# Altium schematic sheet USB.SchDoc: USB
size 431 x 279 mm; CheckedBy: Lance Bantoto; Engineer: Cindy Li; Organization: UW Robotics; Address1: 200 University Avenue; Address2: Waterloo; Address3: Ontario; Address4: Canada N2L 3G6; DocumentNumber: 13; Revision: 1; SheetNumber: 13; SheetTotal: 23
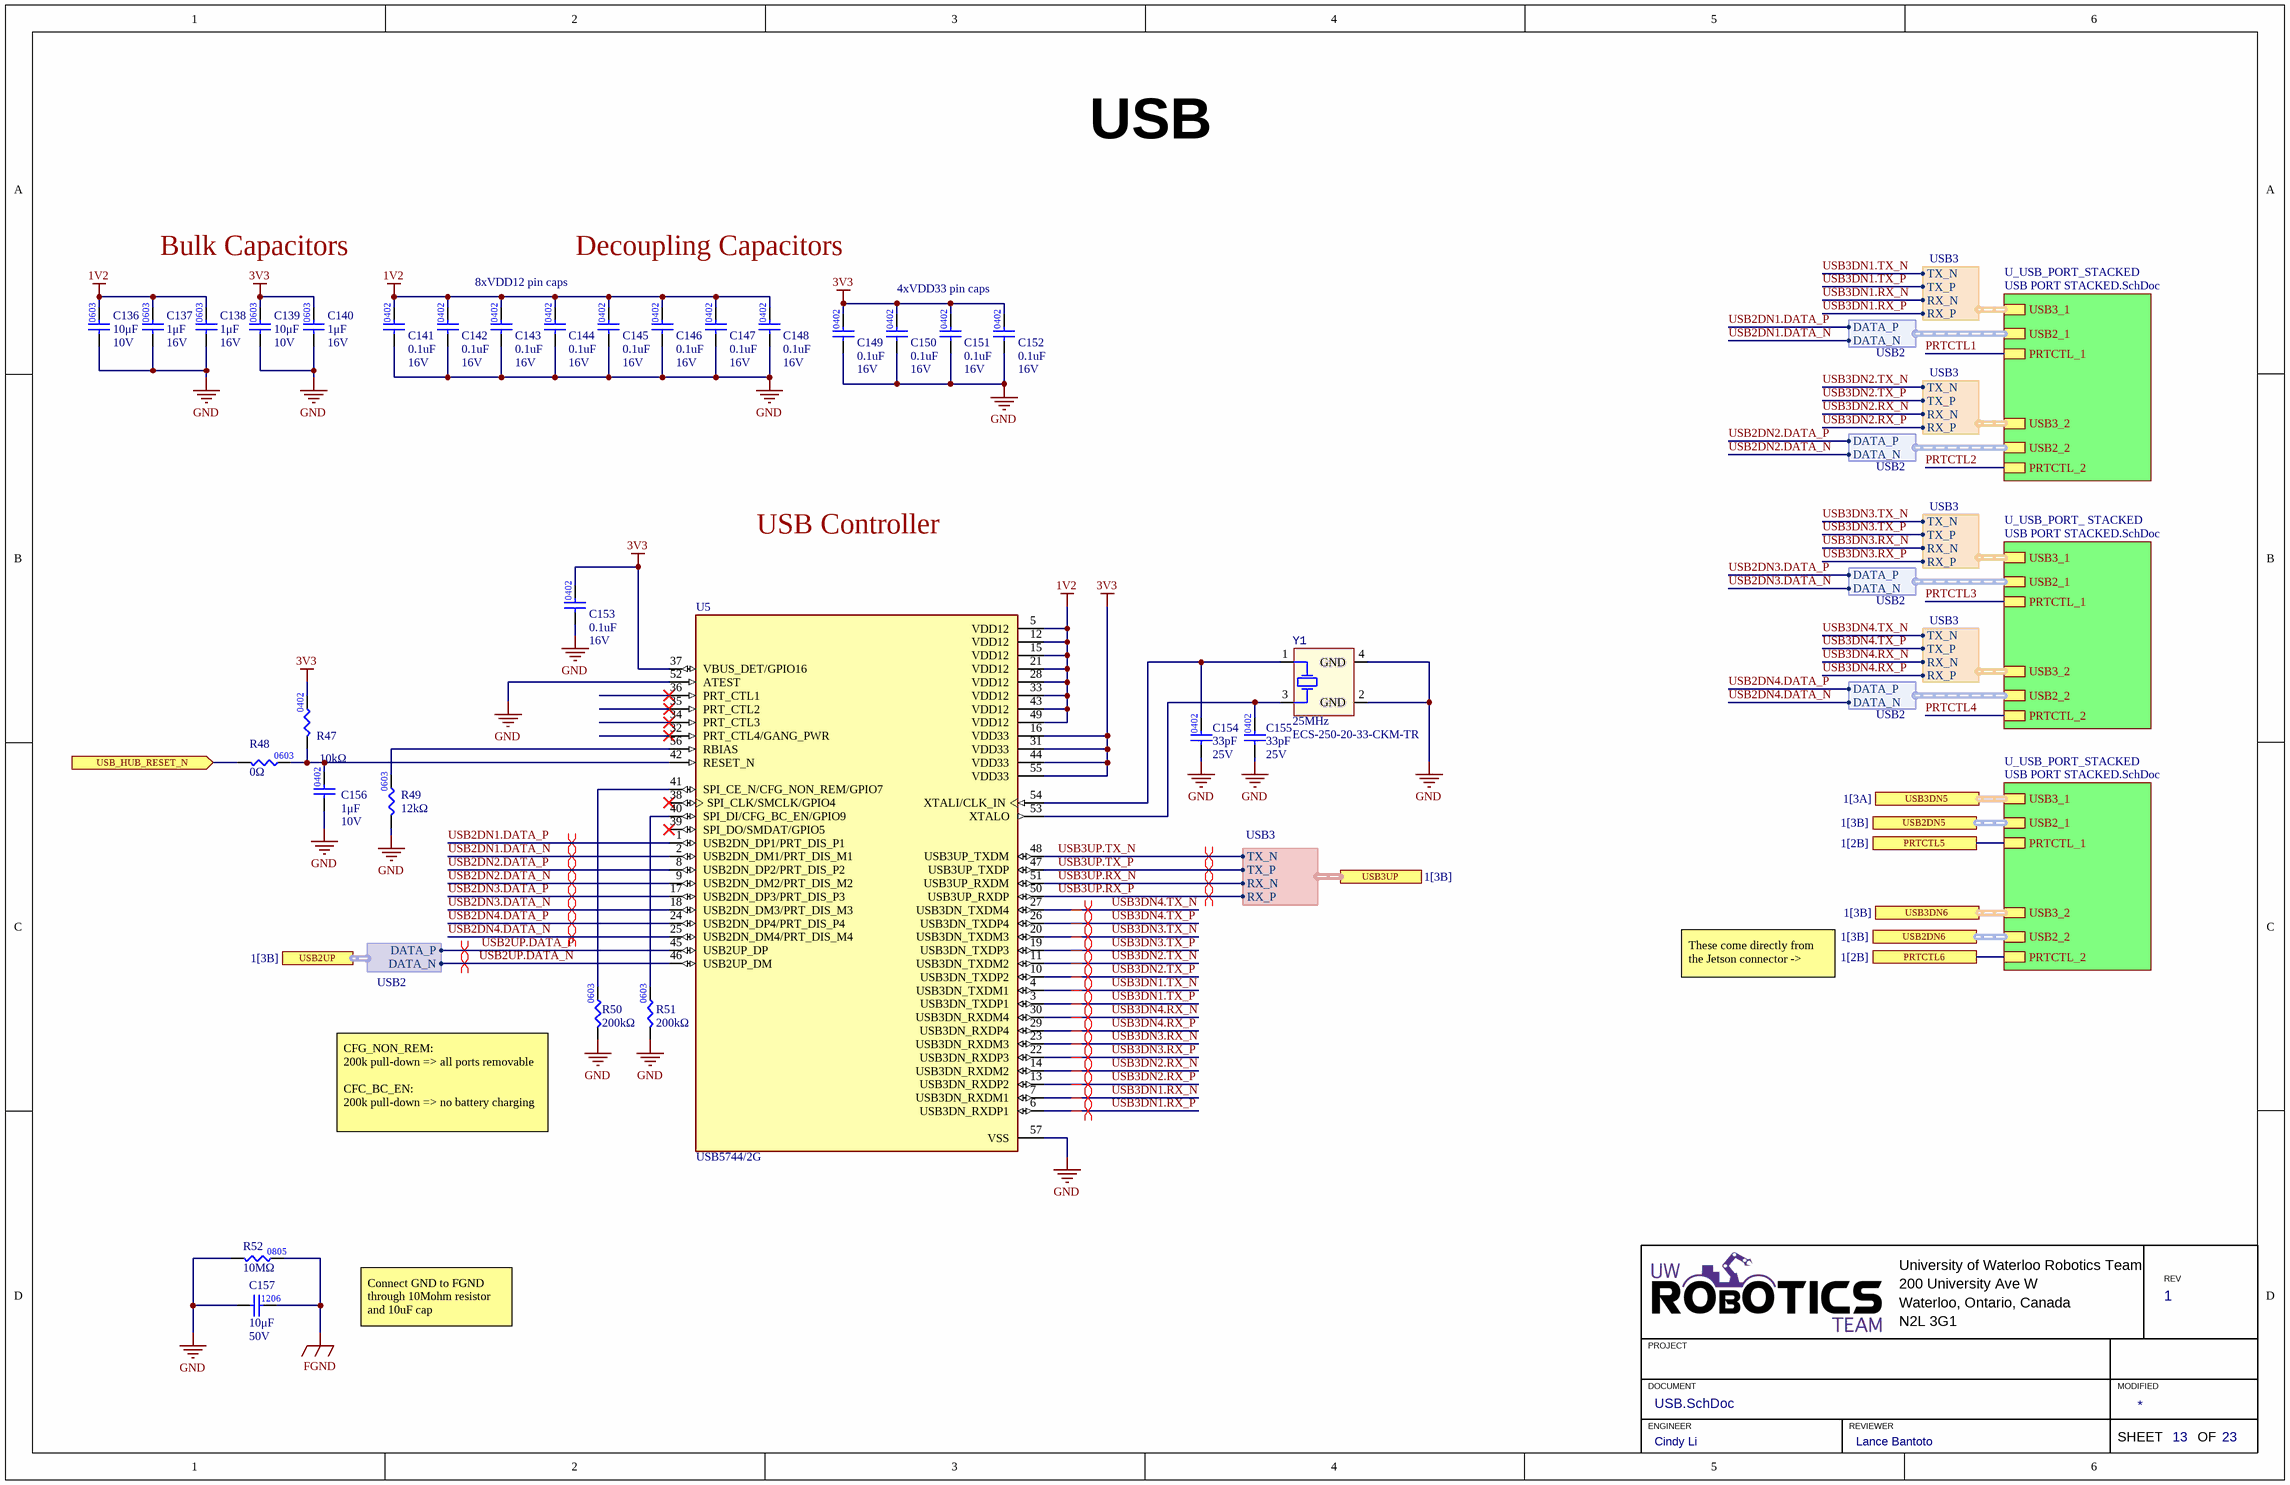
[diagram p0: USB.SchDoc]

## Parts
C136  value 10μF  Voltage Rating: 10V  [CAP0603]  (hidden comment: CAP_10uF_10V_0603)
C137  value 1μF  Voltage Rating: 16V  [CAP0603]  (hidden comment: CAP_1uF_16V_0603)
C138  value 1μF  Voltage Rating: 16V  [CAP0603]  (hidden comment: CAP_1uF_16V_0603)
C139  value 10μF  Voltage Rating: 10V  [CAP0603]  (hidden comment: CAP_10uF_10V_0603)
C140  value 1μF  Voltage Rating: 16V  [CAP0603]  (hidden comment: CAP_1uF_16V_0603)
C141  Rated DC Voltage (URdc): 16V  Capacitance: 0.1uF  [CAP0402]  (hidden comment: CAP_0.1uF_16V_X7R_0402)
C142  Rated DC Voltage (URdc): 16V  Capacitance: 0.1uF  [CAP0402]  (hidden comment: CAP_0.1uF_16V_X7R_0402)
C143  Rated DC Voltage (URdc): 16V  Capacitance: 0.1uF  [CAP0402]  (hidden comment: CAP_0.1uF_16V_X7R_0402)
C144  Rated DC Voltage (URdc): 16V  Capacitance: 0.1uF  [CAP0402]  (hidden comment: CAP_0.1uF_16V_X7R_0402)
C145  Rated DC Voltage (URdc): 16V  Capacitance: 0.1uF  [CAP0402]  (hidden comment: CAP_0.1uF_16V_X7R_0402)
C146  Rated DC Voltage (URdc): 16V  Capacitance: 0.1uF  [CAP0402]  (hidden comment: CAP_0.1uF_16V_X7R_0402)
C147  Rated DC Voltage (URdc): 16V  Capacitance: 0.1uF  [CAP0402]  (hidden comment: CAP_0.1uF_16V_X7R_0402)
C148  Rated DC Voltage (URdc): 16V  Capacitance: 0.1uF  [CAP0402]  (hidden comment: CAP_0.1uF_16V_X7R_0402)
C149  Rated DC Voltage (URdc): 16V  Capacitance: 0.1uF  [CAP0402]  (hidden comment: CAP_0.1uF_16V_X7R_0402)
C150  Rated DC Voltage (URdc): 16V  Capacitance: 0.1uF  [CAP0402]  (hidden comment: CAP_0.1uF_16V_X7R_0402)
C151  Rated DC Voltage (URdc): 16V  Capacitance: 0.1uF  [CAP0402]  (hidden comment: CAP_0.1uF_16V_X7R_0402)
C152  Rated DC Voltage (URdc): 16V  Capacitance: 0.1uF  [CAP0402]  (hidden comment: CAP_0.1uF_16V_X7R_0402)
C153  Rated DC Voltage (URdc): 16V  Capacitance: 0.1uF  [CAP0402]  (hidden comment: CAP_0.1uF_16V_X7R_0402)
C154  value 33pF  Voltage Rating: 25V  [CAP0402]  (hidden comment: CAP_33pF_25V_0402)
C155  value 33pF  Voltage Rating: 25V  [CAP0402]  (hidden comment: CAP_33pF_25V_0402)
C156  Capacitance: 1μF  Rated DC Voltage (URdc): 10V  [CAP0402]  (hidden comment: CAP_1UF_10V_0402_X5R)
C157  value 10μF  Voltage Rating: 50V  [CAP1206]  (hidden comment: CAP_10uF_50V_1206)
R47  Resistance: 10kΩ  [RES0402]  (hidden comment: RES_10kΩ_0402_1%)
R48  value 0Ω  [RES0603]  (hidden comment: RES_0Ω_0603)
R49  value 12kΩ  [RES0603]  (hidden comment: RES_12kΩ_0603)
R50  value 200kΩ  [RES0603]  (hidden comment: RES_200kΩ_0603_5%)
R51  value 200kΩ  [RES0603]  (hidden comment: RES_200kΩ_0603_5%)
R52  value 10MΩ  [RES0805]  (hidden comment: RES_10MΩ_0805)
U5  USB5744/2G  [QFN40P700X700X100-57N]
Y1  Frequency: 25MHz  Manufacturer Part Number 1: ECS-250-20-33-CKM-TR  [XTAL_ECS-250-20-33-CKM-TR]  (hidden comment: CRYSTAL_25MHZ_20PF)

## Sub-sheets
U_USB_PORT_ STACKED = USB PORT STACKED.SchDoc: USB3_1 (harness USB3), PRTCTL_1, USB2_1 (harness USB2), USB3_2 (harness USB3), USB2_2 (harness USB2), PRTCTL_2
U_USB_PORT_STACKED = USB PORT STACKED.SchDoc: USB3_1 (harness USB3), PRTCTL_1, USB2_1 (harness USB2), USB3_2 (harness USB3), USB2_2 (harness USB2), PRTCTL_2
U_USB_PORT_STACKED = USB PORT STACKED.SchDoc: USB3_1 (harness USB3), PRTCTL_1, USB2_1 (harness USB2), USB3_2 (harness USB3), USB2_2 (harness USB2), PRTCTL_2

## Ports
PRTCTL5 (see 1[2B]), PRTCTL6 (see 1[2B]), USB2DN5 (see 1[3B]), USB2DN6 (see 1[3B]), USB2UP (harness USB2, see 1[3B]), USB3DN5 (see 1[3A]), USB3DN6 (see 1[3B]), USB3UP (harness USB3, see 1[3B]), USB_HUB_RESET_N (in)

## Harnesses
USB3: TX_N, TX_P, RX_N, RX_P
USB2: DATA_P, DATA_N
USB3: RX_N, RX_P, TX_P, TX_N

## Nets
1V2: C136.2 C137.2 C138.2 C141.2 C142.2 C143.2 C144.2 C145.2 C146.2 C147.2 C148.2 U5.5(VDD12) U5.12(VDD12) U5.15(VDD12) U5.21(VDD12) U5.28(VDD12) U5.33(VDD12) U5.43(VDD12) U5.49(VDD12)
3V3: C139.2 C140.2 C149.2 C150.2 C151.2 C152.2 C153.2 R47.2 U5.16(VDD33) U5.31(VDD33) U5.37(VBUS_DET/GPIO16) U5.44(VDD33) U5.55(VDD33)
FGND: C157.2 R52.2
GND: C136.1 C137.1 C138.1 C139.1 C140.1 C141.1 C142.1 C143.1 C144.1 C145.1 C146.1 C147.1 C148.1 C149.1 C150.1 C151.1 C152.1 C153.1 C154.1 C155.1 C156.1 C157.1 R49.1 R50.1 R51.1 R52.1 U5.52(ATEST) U5.57(VSS) Y1.2(GND) Y1.4(GND)
PRTCTL1: sheet U_USB_PORT_STACKED/PRTCTL_1
PRTCTL2: sheet U_USB_PORT_STACKED/PRTCTL_2
PRTCTL3: sheet U_USB_PORT_ STACKED/PRTCTL_1
PRTCTL4: sheet U_USB_PORT_ STACKED/PRTCTL_2
PRTCTL5: port PRTCTL5, sheet U_USB_PORT_STACKED/PRTCTL_1
PRTCTL6: port PRTCTL6, sheet U_USB_PORT_STACKED/PRTCTL_2
USB2DN1.DATA_N: U5.2(USB2DN_DM1/PRT_DIS_M1) ; sheet U_USB_PORT_STACKED/USB2_1.DATA_N
USB2DN1.DATA_P: U5.1(USB2DN_DP1/PRT_DIS_P1) ; sheet U_USB_PORT_STACKED/USB2_1.DATA_P
USB2DN2.DATA_N: U5.9(USB2DN_DM2/PRT_DIS_M2) ; sheet U_USB_PORT_STACKED/USB2_2.DATA_N
USB2DN2.DATA_P: U5.8(USB2DN_DP2/PRT_DIS_P2) ; sheet U_USB_PORT_STACKED/USB2_2.DATA_P
USB2DN3.DATA_N: U5.18(USB2DN_DM3/PRT_DIS_M3) ; sheet U_USB_PORT_ STACKED/USB2_1.DATA_N
USB2DN3.DATA_P: U5.17(USB2DN_DP3/PRT_DIS_P3) ; sheet U_USB_PORT_ STACKED/USB2_1.DATA_P
USB2DN4.DATA_N: U5.25(USB2DN_DM4/PRT_DIS_M4) ; sheet U_USB_PORT_ STACKED/USB2_2.DATA_N
USB2DN4.DATA_P: U5.24(USB2DN_DP4/PRT_DIS_P4) ; sheet U_USB_PORT_ STACKED/USB2_2.DATA_P
USB2UP.DATA_N: U5.46(USB2UP_DM) ; port USB2UP.DATA_N
USB2UP.DATA_P: U5.45(USB2UP_DP) ; port USB2UP.DATA_P
USB3DN1.RX_N: U5.7(USB3DN_RXDM1) ; sheet U_USB_PORT_STACKED/USB3_1.RX_N
USB3DN1.RX_P: U5.6(USB3DN_RXDP1) ; sheet U_USB_PORT_STACKED/USB3_1.RX_P
USB3DN1.TX_N: U5.4(USB3DN_TXDM1) ; sheet U_USB_PORT_STACKED/USB3_1.TX_N
USB3DN1.TX_P: U5.3(USB3DN_TXDP1) ; sheet U_USB_PORT_STACKED/USB3_1.TX_P
USB3DN2.RX_N: U5.14(USB3DN_RXDM2) ; sheet U_USB_PORT_STACKED/USB3_2.RX_N
USB3DN2.RX_P: U5.13(USB3DN_RXDP2) ; sheet U_USB_PORT_STACKED/USB3_2.RX_P
USB3DN2.TX_N: U5.11(USB3DN_TXDM2) ; sheet U_USB_PORT_STACKED/USB3_2.TX_N
USB3DN2.TX_P: U5.10(USB3DN_TXDP2) ; sheet U_USB_PORT_STACKED/USB3_2.TX_P
USB3DN3.RX_N: U5.23(USB3DN_RXDM3) ; sheet U_USB_PORT_ STACKED/USB3_1.RX_N
USB3DN3.RX_P: U5.22(USB3DN_RXDP3) ; sheet U_USB_PORT_ STACKED/USB3_1.RX_P
USB3DN3.TX_N: U5.20(USB3DN_TXDM3) ; sheet U_USB_PORT_ STACKED/USB3_1.TX_N
USB3DN3.TX_P: U5.19(USB3DN_TXDP3) ; sheet U_USB_PORT_ STACKED/USB3_1.TX_P
USB3DN4.RX_N: U5.30(USB3DN_RXDM4) ; sheet U_USB_PORT_ STACKED/USB3_2.RX_N
USB3DN4.RX_P: U5.29(USB3DN_RXDP4) ; sheet U_USB_PORT_ STACKED/USB3_2.RX_P
USB3DN4.TX_N: U5.27(USB3DN_TXDM4) ; sheet U_USB_PORT_ STACKED/USB3_2.TX_N
USB3DN4.TX_P: U5.26(USB3DN_TXDP4) ; sheet U_USB_PORT_ STACKED/USB3_2.TX_P
USB3UP.RX_N: U5.51(USB3UP_RXDM) ; port USB3UP.RX_N
USB3UP.RX_P: U5.50(USB3UP_RXDP) ; port USB3UP.RX_P
USB3UP.TX_N: U5.48(USB3UP_TXDM) ; port USB3UP.TX_N
USB3UP.TX_P: U5.47(USB3UP_TXDP) ; port USB3UP.TX_P
USB_HUB_RESET_N: R48.1 ; port USB_HUB_RESET_N
NetC154_2: C154.2 U5.54(XTALI/CLK_IN) Y1.1(HOT)
NetC155_2: C155.2 U5.53(XTALO) Y1.3(HOT)
NetC156_2: C156.2 R47.1 R48.2 U5.42(RESET_N)
NetR49_2: R49.2 U5.56(RBIAS)
NetR50_2: R50.2 U5.41(SPI_CE_N/CFG_NON_REM/GPIO7)
NetR51_2: R51.2 U5.40(SPI_DI/CFG_BC_EN/GPIO9)

Not connected (* = marked no-connect by the designer): U5 32(PRT_CTL4/GANG_PWR)* 34(PRT_CTL3)* 35(PRT_CTL2)* 36(PRT_CTL1)* 38(SPI_CLK/SMCLK/GPIO4)* 39(SPI_DO/SMDAT/GPIO5)*

## Buses and harness runs
harness port USB2DN5 = sheet U_USB_PORT_STACKED/USB2_1
harness port USB2DN6 = sheet U_USB_PORT_STACKED/USB2_2
harness port USB3DN5 = sheet U_USB_PORT_STACKED/USB3_1
harness port USB3DN6 = sheet U_USB_PORT_STACKED/USB3_2

## Layout directives
differential pair: USB2DN1.DATA_N, USB2DN1.DATA_P, USB2DN2.DATA_N, USB2DN2.DATA_P, USB2DN3.DATA_N, USB2DN3.DATA_P, USB2DN4.DATA_N, USB2DN4.DATA_P, USB2UP.DATA_N, USB2UP.DATA_P, USB3DN1.RX_N, USB3DN1.RX_P, USB3DN1.TX_N, USB3DN1.TX_P, USB3DN2.RX_N, USB3DN2.RX_P, USB3DN2.TX_N, USB3DN2.TX_P, USB3DN3.RX_N, USB3DN3.RX_P, USB3DN3.TX_N, USB3DN3.TX_P, USB3DN4.RX_N, USB3DN4.RX_P, USB3DN4.TX_N, USB3DN4.TX_P, USB3UP.RX_N, USB3UP.RX_P, USB3UP.TX_N, USB3UP.TX_P

## Notes on the sheet
- Bulk Capacitors
- 8xVDD12 pin caps
- Decoupling Capacitors
- 4xVDD33 pin caps
- USB Controller
- These come directly from the Jetson connector ->
- (near R50) CFG_NON_REM:
  200k pull-down => all ports removable
  CFC_BC_EN:
  200k pull-down => no battery charging
- Connect GND to FGND through 10Mohm resistor and 10uF cap
- University of Waterloo Robotics Team
- 200 University Ave W
- REV
- PROJECT
- Waterloo, Ontario, Canada
- N2L 3G1
- DOCUMENT
- ENGINEER
- REVIEWER
- MODIFIED
- SHEET
- OF
- (in symbol CAP_10uF_10V_0603) 0603
- (in symbol RES_10MΩ_0805_5%) 0805

## Library data of the parts
C136 C139 = CAP_10uF_10V_0603: CAP CER 10UF 10V X5R 0603; Manufacturer 1: Yageo; Manufacturer Part Number 1: CC0603MRX5R6BB106; Supplier Part Number 1: 311-1817-1-ND; Supplier 1: Digi-Key; Dielectric: X5R
C137 C138 C140 = CAP_1uF_16V_0603: CAP CER 1UF 16V Y5V 0603; Manufacturer Part Number 1: CC0603ZRY5V7BB105; Manufacturer 1: Yageo; Package/Footprint: 0603; Supplier Part Number 1: 311-1372-1-ND; Supplier 1: Digi-Key; Dielectric: Y5V; Mounting Type: SMD
C141-C153 = CAP_0.1uF_16V_X7R_0402: Ceramic Capacitor, Ceramic; Manufacturer: Taiyo Yuden; Manufacturer Part Number: LMK212AC6106MD-T; Multilayer: Yes; Negative Tolerance: 10%; Temperature Characteristics Code: X7R; Supplier Part Number 1: 587-6337-1-ND; Supplier 1: Digi-Key; RoHS: Yes; Stock 1: 703; Pricing 1: 1=0.29000, 10=0.20100, 50=0.12060, 100=0.10180, 500=0.06966, 1000=0.06163 (USD); ComponentLink1URL: https://datasheet.ciiva.com:443/pdfs/VipMasterIC/IC/TAIY/TAIY-S-A0009099504/TAIY-S-A0009099407-1.pdf?src-supplier=IHS+Markit; ComponentLink1Description: https://datasheet.ciiva.com:443/pdfs/VipMasterIC/IC/TAIY/TAIY-S-A0009099504/TAIY-S-A0009099407-1.pdf?src-supplier=IHS+Markit; ComponentLink2URL: https://ds.yuden.co.jp/TYCOMPAS/ut/detail?pn=LMK212AC6106MD-T &amp;u=M&src-supplier=Digi-Key; ComponentLink2Description: https://ds.yuden.co.jp/TYCOMPAS/ut/detail?pn=LMK212AC6106MD-T &amp;u=M&src-supplier=Digi-Key; Supplier 2: Digi-Key; Supplier Part Number 2: 1292-1630-1-ND; Category: Ceramic Capacitors; Stock 2: 20327886; Pricing 2: 1=0.10000, 10=0.02800, 50=0.01500, 100=0.01220, 500=0.00876, 1000=0.00688, 2500=0.00625, 5000=0.00575 (USD); Mount: Surface Mount; Number of Pins: 2; Dielectric Material: Ceramic; Package Shape: Rectangular; Terminal Finish: Nickel; Min Operating Temperature: -55°C; Max Operating Temperature: 125°C; JESD-609 Code: e3; Capacitor Type: Ceramic; Package Style: SMTMeter; Packaging: Tape and Reel; Positive Tolerance: 10%; Termination: Wraparound; Length: 1mm; Width: 0.5mm; Height: 0.5mm; REACH SVHC: Yes; RoHS Compliant: Yes; ComponentLink3URL: https://datasheet.ciiva.com:443/pdfs/VipMasterIC/IC/WATC/WATC-S-A0009550342/WATC-S-A0009550342-1.pdf?src-supplier=IHS+Markit; ComponentLink3Description: https://datasheet.ciiva.com:443/pdfs/VipMasterIC/IC/WATC/WATC-S-A0009550342/WATC-S-A0009550342-1.pdf?src-supplier=IHS+Markit; ComponentLink4URL: http://www.farnell.com/datasheets/2340522.pdf?src-supplier=Farnell; ComponentLink4Description: http://www.farnell.com/datasheets/2340522.pdf?src-supplier=Farnell; ComponentLink5URL: http://components.arrow.com/part/dataview/0323_00654690?src-supplier=Arrow+Europe; ComponentLink5Description: http://components.arrow.com/part/dataview/0323_00654690?src-supplier=Arrow+Europe; ComponentLink6URL: https://www.verical.com/server-webapp/html/getDatasheet?partID=415228&src-supplier=Verical; ComponentLink6Description: https://www.verical.com/server-webapp/html/getDatasheet?partID=415228&src-supplier=Verical; ComponentLink7URL: http://www.passivecomponent.com/indexsea/0402B104K160CT-IN.pdf?src-supplier=Digi-Key; ComponentLink7Description: http://www.passivecomponent.com/indexsea/0402B104K160CT-IN.pdf?src-supplier=Digi-Key; ComponentLink8URL: http://www.passivecomponent.com/wp-content/uploads/2018/10/MLCC.pdf?src-supplier=Digi-Key; ComponentLink8Description: http://www.passivecomponent.com/wp-content/uploads/2018/10/MLCC.pdf?src-supplier=Digi-Key; ComponentLink9URL: http://www.farnell.com/datasheets/2340522.pdf?src-supplier=Element14; ComponentLink9Description: http://www.farnell.com/datasheets/2340522.pdf?src-supplier=Element14; ComponentLink10URL: http://www.farnell.com/datasheets/2340522.pdf?src-supplier=Newark; ComponentLink10Description: http://www.farnell.com/datasheets/2340522.pdf?src-supplier=Newark; Size Code: 0402; Supplier 3: Digi-Key; Supplier Part Number 3: 445-173645-1-ND; Stock 3: 3627; Pricing 3: 1=0.20000, 10=0.14200, 50=0.08080, 100=0.06700, 500=0.04696, 1000=0.03888, 2500=0.03619, 5000=0.03311 (USD); ComponentLink11URL: https://datasheet.ciiva.com:443/pdfs/VipMasterIC/IC/TDKC/TDKC-S-A0007785269/TDKC-S-A0007785269-1.pdf?src-supplier=IHS+Markit; ComponentLink11Description: https://datasheet.ciiva.com:443/pdfs/VipMasterIC/IC/TDKC/TDKC-S-A0007785269/TDKC-S-A0007785269-1.pdf?src-supplier=IHS+Markit; ComponentLink12URL: https://product.tdk.com/info/en/catalog/spec/mlccspec_commercial_soft_en.pdf?src-supplier=Digi-Key; ComponentLink12Description: https://product.tdk.com/info/en/catalog/spec/mlccspec_commercial_soft_en.pdf?src-supplier=Digi-Key
C154 C155 = CAP_33pF_25V_0402: CAP CER 33PF 25V C0G/NP0 0402; Manufacturer 1: AVX Corporation; Manufacturer Part Number 1: 04023A330JAT2A; Package/Footprint: 0402; Dielectric: C0G; Supplier 1: Digi-Key; Mounting Type: SMD; Supplier Part Number 1: 478-12613-1-ND
C156 = CAP_1UF_10V_0402_X5R: CAP CER 1UF 10V X5R 0402; Manufacturer: Kyocera AVX; Manufacturer Part Number: 0402ZD105MAT2A; Supplier Part Number 1: 478-5768-1-ND; Supplier 1: Digi-Key; Temperature Characteristics Code: X5R; ComponentLink7URL: https://datasheet.ciiva.com/11531/cx5r-11531784.pdf?src-supplier=Avnet; ComponentLink7Description: https://datasheet.ciiva.com/11531/cx5r-11531784.pdf?src-supplier=Avnet; Mounting Type: Surface Mount; Package: 0402
C157 = CAP_10uF_50V_1206: CAP CER 10UF 50V X5R 1206; Manufacturer 1: Murata; Manufacturer Part Number 1: GRT31CR61H106KE01L; Package/Footprint: 1206; Supplier Part Number 1: 490-12456-1-ND; Supplier 1: Digi-Key; Mounting Type: SMD; Dielectric: X5R
R47 = RES_10kΩ_0402_1%: RES 10K OHM 1% 1/16W 0402; Manufacturer Part Number 1: RC1005F103CS; Manufacturer 1: Samsung Electro-Mechanics; Supplier 1: Digi-Key; Supplier Part Number 1: 1276-3431-1-ND; Tolerance: 1%; Package: 0402
R48 = RES_0Ω_0603: RES 0 OHM JUMPER 1/10W 0603; Manufacturer 1: Yageo; Manufacturer Part Number 1: RC0603JR-070RL; Package/Footprint: 0603; Supplier Part Number 1: 311-0.0GRCT-ND; Supplier 1: Digi-Key; Mounting Type: SMD
R49 = RES_12kΩ_0603_1%: RES 12K OHM 1% 1/10W 0603; Manufacturer 1: Vishay Dale; Manufacturer Part Number 1: CRCW060312K0FKEAC; Power: 0.1W; Supplier Part Number 1: 541-4046-1-ND; Supplier 1: Digi-Key; Tolerance: 1%; Package: 0603
R50 R51 = RES_200kΩ_0603_5%: RES SMD 200K OHM 5% 1/10W 0603; Manufacturer 1: Panasonic Electronic Components; Manufacturer Part Number 1: ERJ-3GEYJ204V; Package/Footprint: 0603; Supplier Part Number 1: P200KGCT-ND; Supplier 1: Digi-Key; Mounting Type: SMD
R52 = RES_10MΩ_0805_5%: RES 10M OHM 5% 1/8W 0805; Manufacturer 1: Yageo; Manufacturer Part Number 1: RC0805JR-0710ML; Supplier Part Number 1: 311-10MARCT-ND; Supplier 1: Digi-Key
U5 = USB5744/2G: USB Hub Controller USB 3.1 USB Interface 56-VQFN (7x7); Manufacturer 1: Microchip Technology; Standards: USB 3.1; Supply Voltage: 1.2V, 3.3V; Manufacturer Part Number 1: USB5744/2G; Supplier 1: Digi-Key; Supplier Part Number 1: USB5744/2G-ND; Package: 56-VQFN (7x7)
Y1 = CRYSTAL_25MHZ_20PF: CRYSTAL 25.0000MHZ 20PF SMD; Manufacturer 1: ECS Inc.; Mounting Type: SMD; Package/Footprint: SMD; Load Capacitance: 20pF; Supplier 1: Digi-Key; Supplier Part Number 1: XC1817CT-ND